# EasyEDA Pro project stm32f401rct6v2.eprj, board STM32F401RCT6V2
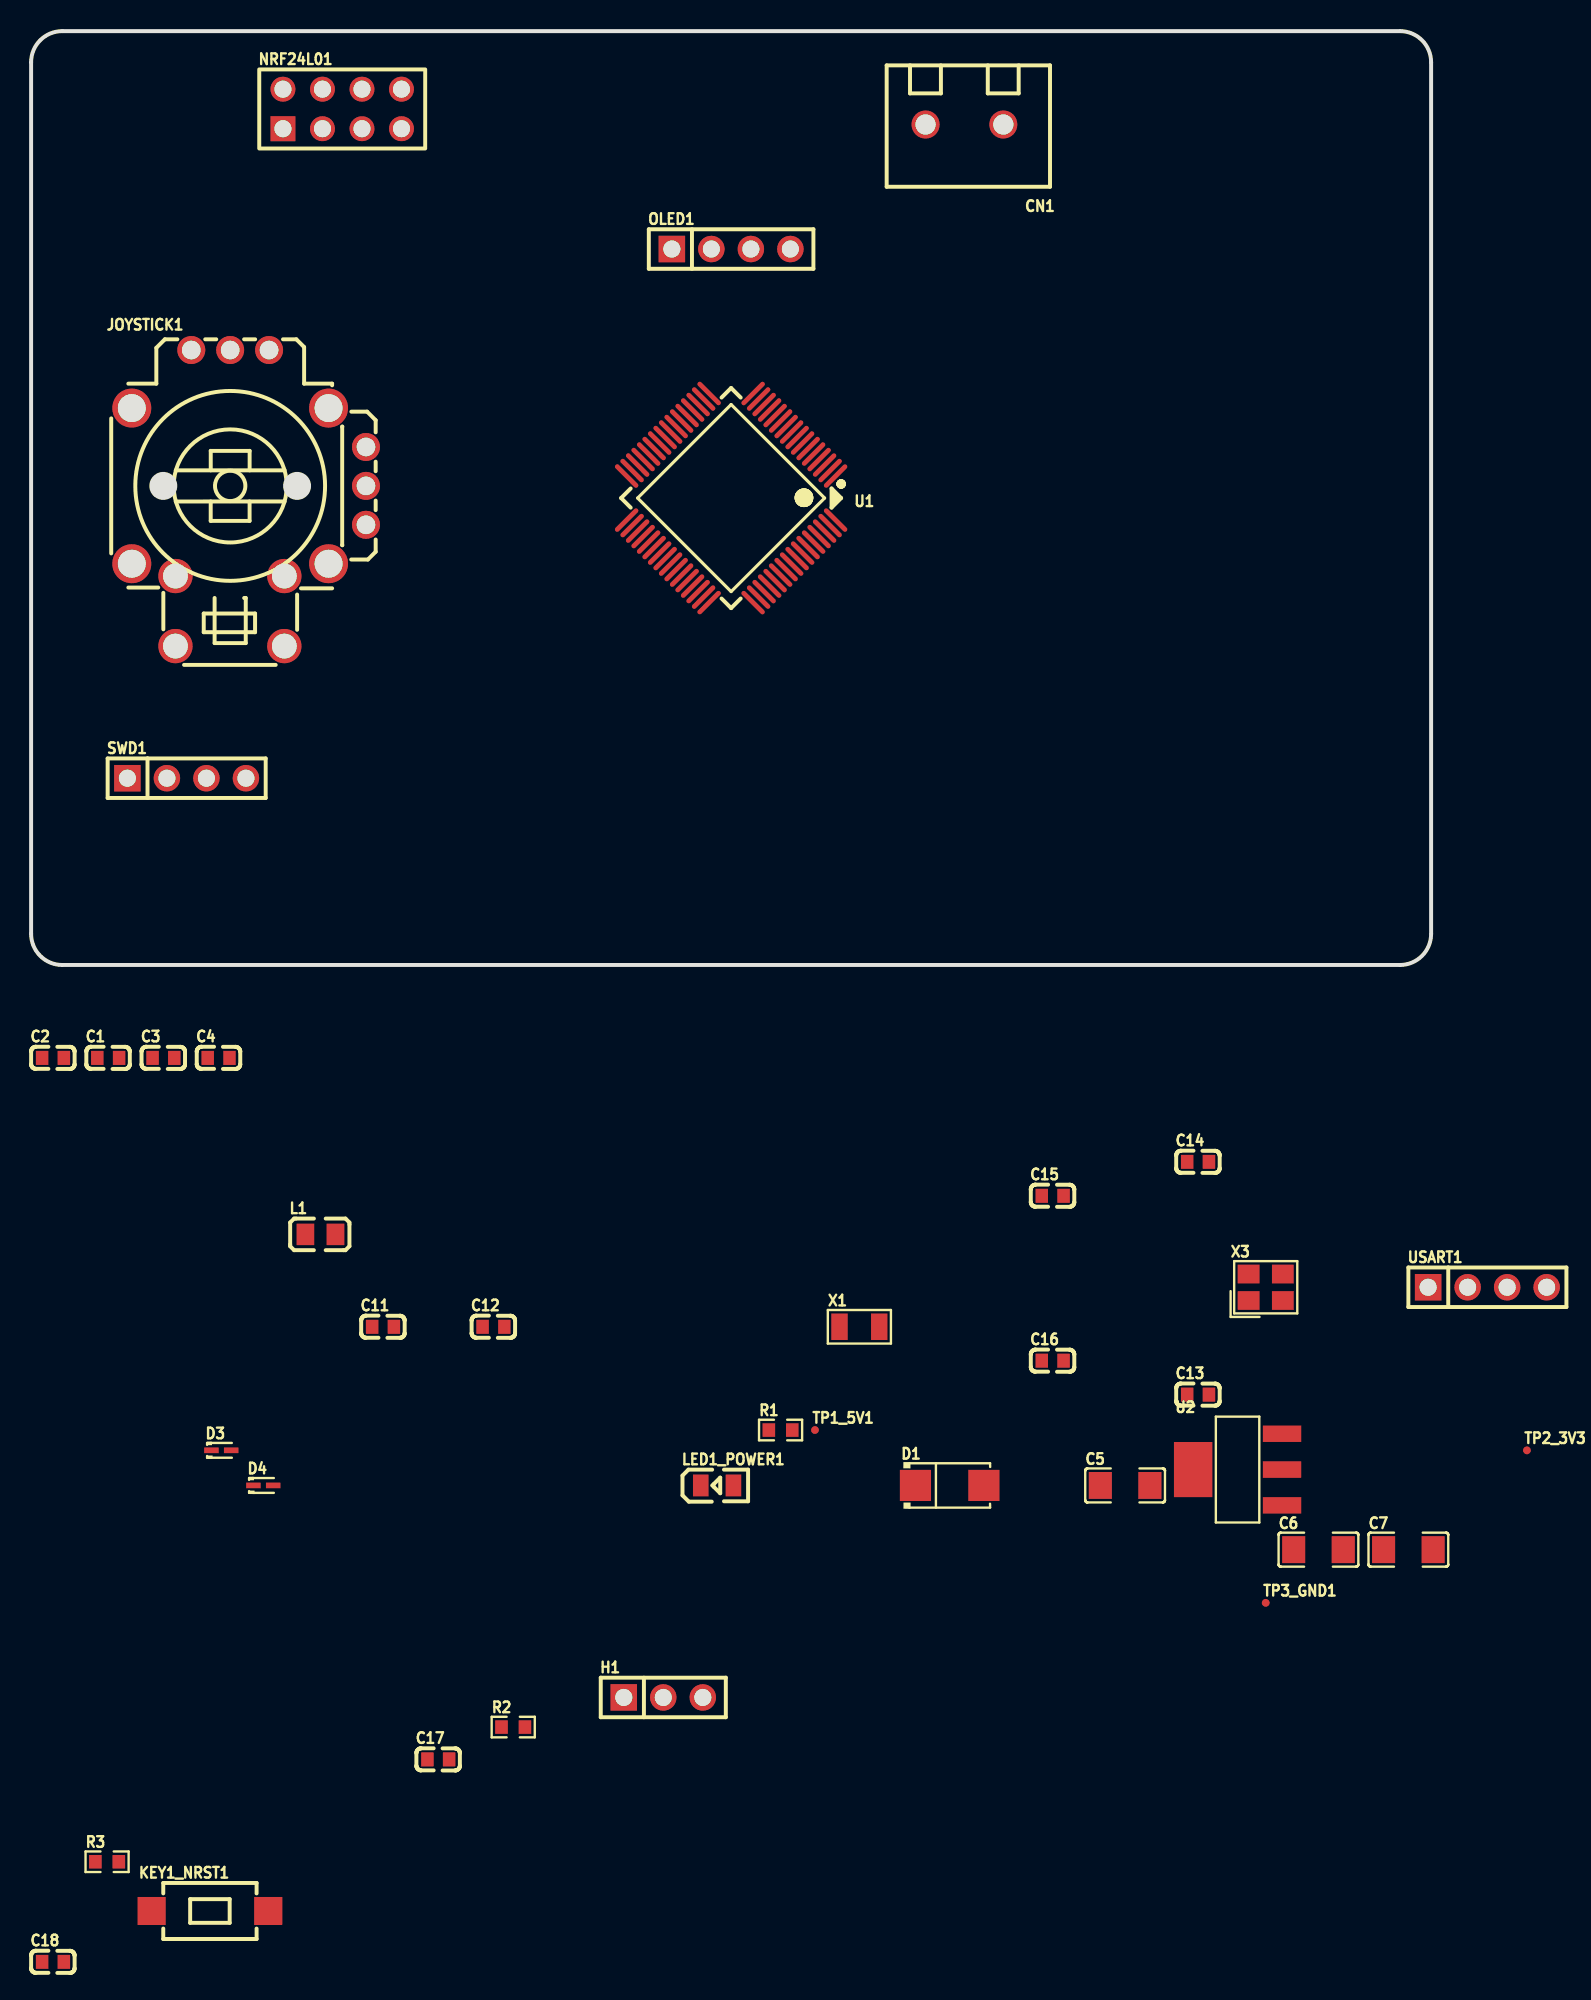
[diagram p4: board, top side]
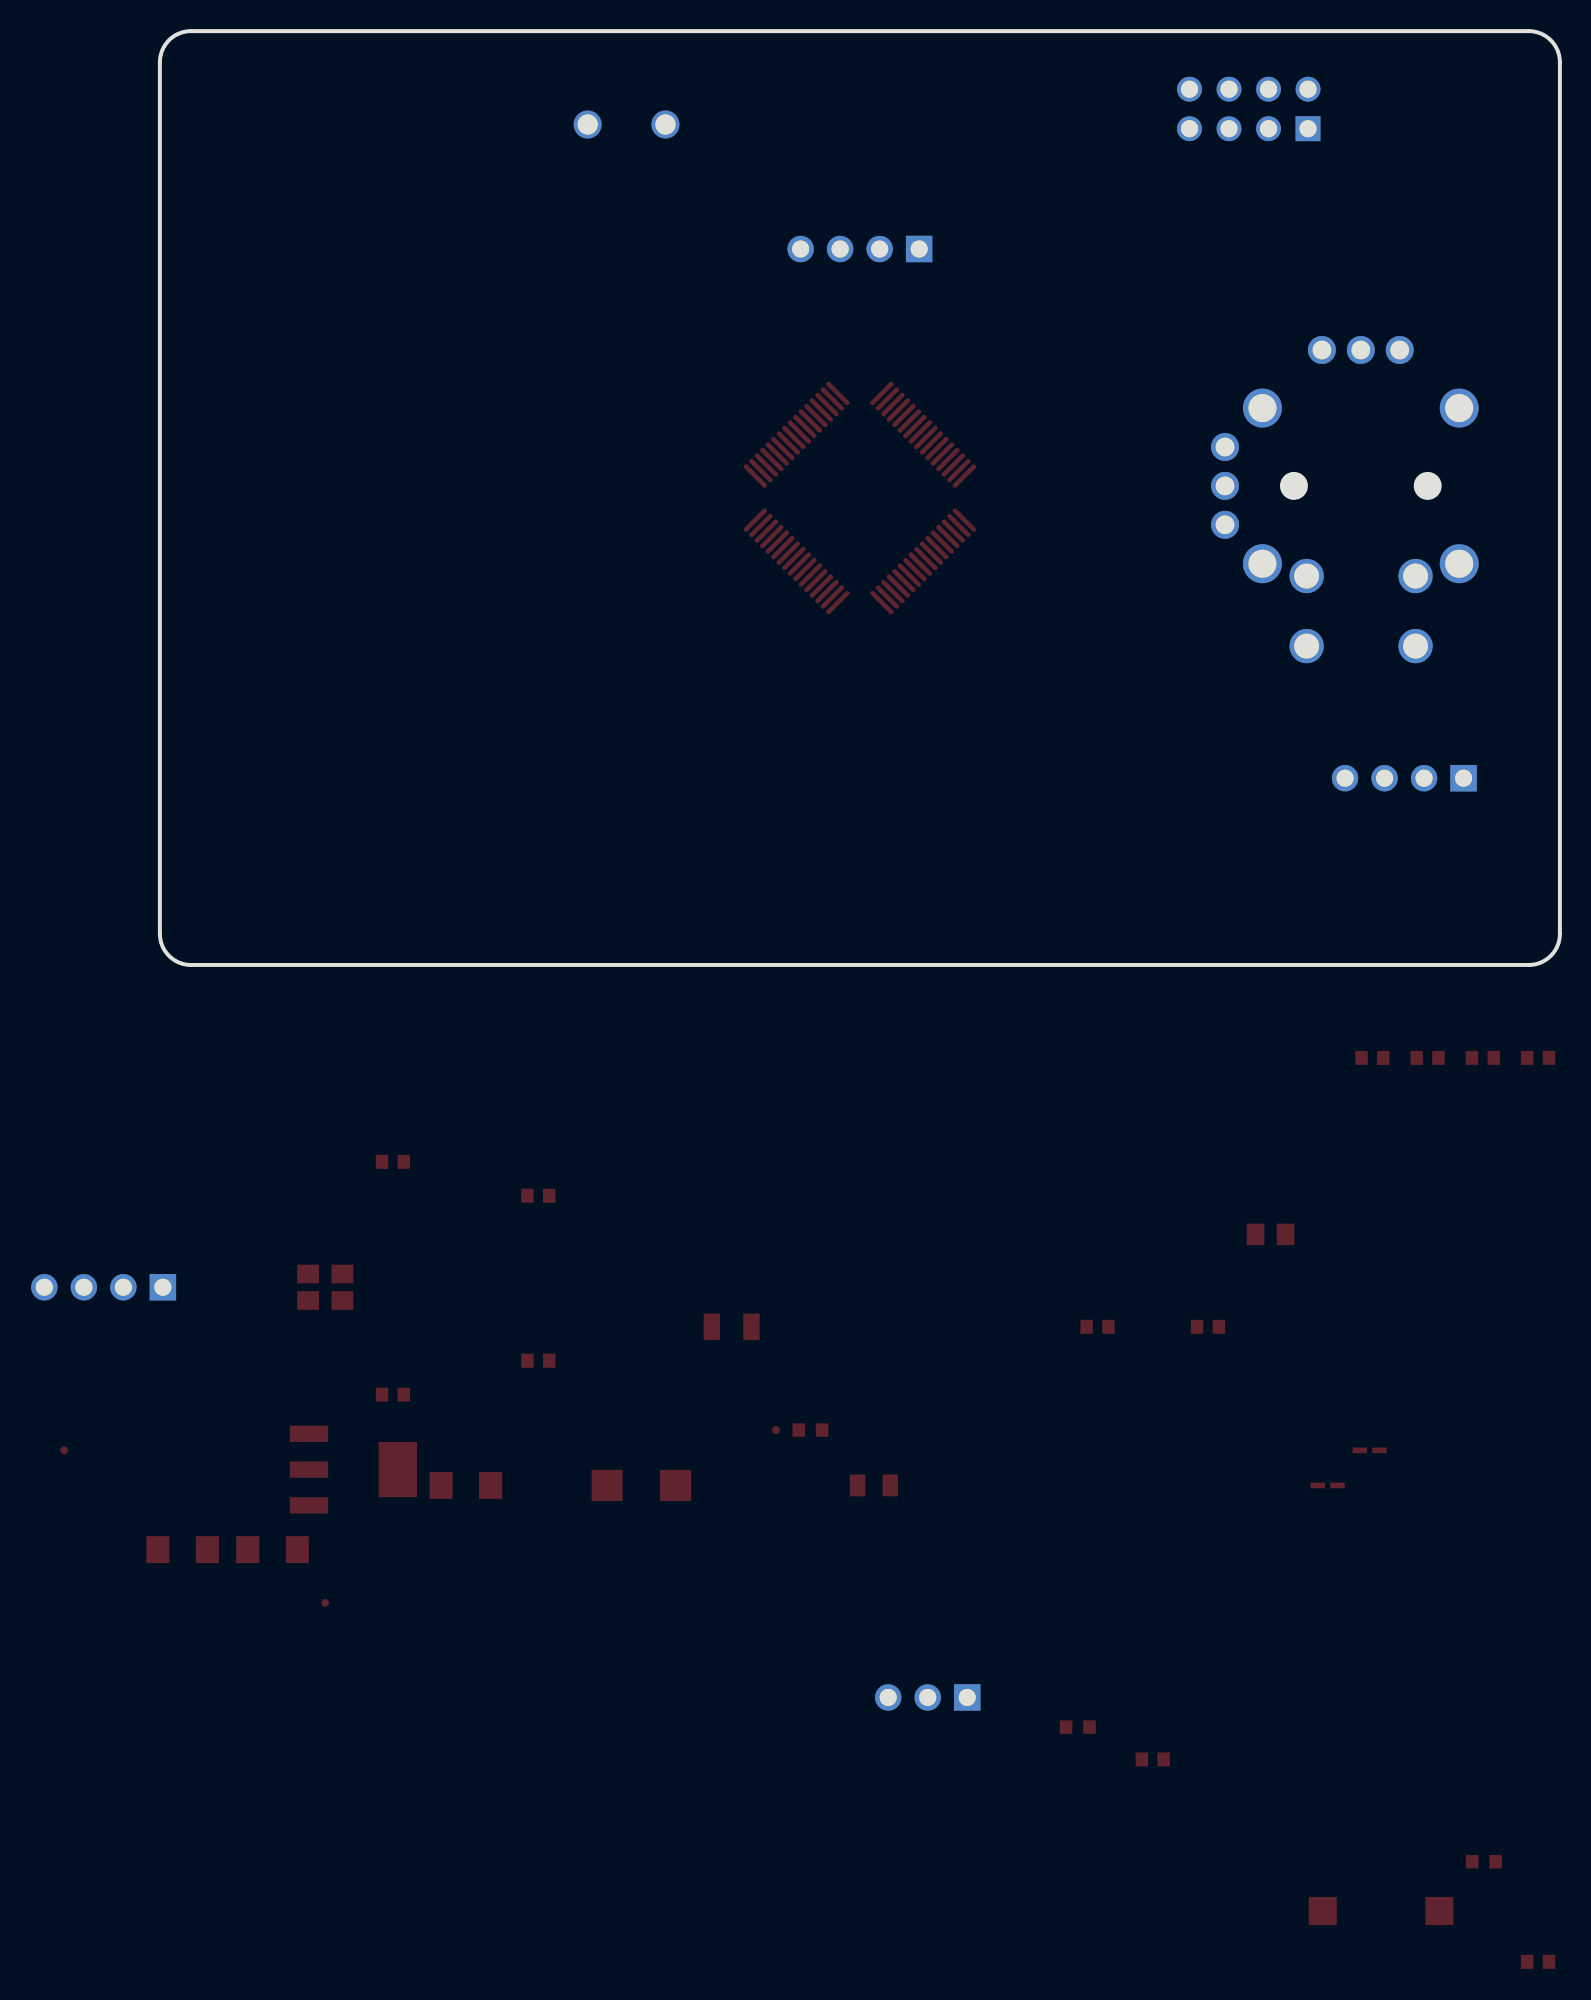
[diagram p5: board, bottom side, seen from below]

Outline 90 x 60 mm; copper layers: Top Layer, Bottom Layer. Coordinates in mm from the lower left corner of the outline.
Outline path: 0,58 0,2 arc(0.59,0.59) 2,0 88,0 arc(89.41,0.59) 90,2 90,58 arc(89.41,59.41) 88,60 2,60 arc(0.59,59.41) 0,58
Stack: Top Layer 0.035mm / Dielectric1 1.51mm FR4 er 4.5 / Bottom Layer 0.035mm

## Design rules (mm)
template: JLCPCB Capability(Two Layers Board)
spacing copperThickness1oz (default): track to track 0.102, other pairs 0.152 to 0.3
spacing copperThickness2oz: track to track 0.203, other pairs 0.152 to 0.3
track width copperThickness1oz (default): min 0.127, default 0.254, max 2.54
track width copperThickness2oz: min 0.203, default 0.254, max 2.54
differential pair differentialPair (default): width min 0.127, default 0.254, max 2.54; gap min 0.152, default 0.152
via viaSize (default): diameter min 0.5, default 0.61, max 10; hole min 0.3, default 0.305, max 6.3

## Placement (name value [footprint] x y rotation side)
C1  100nF  [C0603]  4.95 -5.97 0 top
C2  100nF  [C0603]  1.41 -5.97 0 top
C3  100nF  [C0603]  8.5 -5.97 0 top
C4  100nF  [C0603]  12.05 -5.97 0 top
C5  47uF  [C1206]  70.33 -33.44 0 top
C6  47uF  [C1206]  82.76 -37.57 0 top
C7  100nF  [C1206]  88.54 -37.57 0 top
C11  1uF  [C0603]  22.62 -23.25 0 top
C12  10nF  [C0603]  29.72 -23.25 0 top
C13  22pF  [C0603]  75.02 -27.61 0 top
C14  22pF  [C0603]  75.02 -12.65 0 top
C15  6pF  [C0603]  65.67 -14.83 0 top
C16  6pF  [C0603]  65.67 -25.43 0 top
C17  4.7uF  [C0603]  26.17 -51.04 0 top
C18  100nF  [C0603]  1.41 -64.05 0 top
CN1  MX126-5.0-02P-GN01-Cu-S-A  [CONN-TH_2P-P5.00_MX126-5.0-GN01-02P-CU-S-A]  60 54 180 top
D1  SMAJ5.0A  [SMA_L4.3-W2.6-LS5.2-RD]  59.05 -33.44 0 top
D3  1N4148WT  [SOD-523_L1.2-W0.8-LS1.6-RD]  12.23 -31.18 0 top
D4  1N4148WT  [SOD-523_L1.2-W0.8-LS1.6-RD]  14.93 -33.44 0 top
H1  PZ254V-11-03P  [HDR-TH_3P-P2.54-V-M]  40.64 -47.06 0 top
JOYSTICK1  RKJXV1224005  [SW-TH_RKJXV1224005]  14 30 0 top
KEY1_NRST1  TC-3602-4.3-260G  [KEY-SMD_L6.0-W3.6-LS8.3-L]  11.5 -60.78 0 top
L1  10uH  [L0805]  18.6 -17.31 0 top
LED1_POWER1  NCD0805R1  [LED0805-R-RD]  44.1 -33.44 0 top
NRF24L01  DS1023-2*4SF11  [HDR-TH_8P-P2.54-V-F-R2-C4-S2.54]  20 55 0 top
OLED1  PM254V-11-04-H85  [HDR-TH_4P-P2.54-V-F]  45 46 0 top
R1  1kΩ  [R0603]  48.18 -29.88 0 top
R2  10kΩ  [R0603]  30.99 -48.96 0 top
R3  10kΩ  [R0603]  4.88 -57.62 0 top
SWD1  PZ254V-11-04P  [HDR-TH_4P-P2.54-V-M]  10 12 0 top
TP1_5V1  -  [Test-Point-0.5mm]  50.39 -29.88 0 top
TP2_3V3  -  [Test-Point-0.5mm]  96.16 -31.18 0 top
TP3_GND1  -  [Test-Point-0.5mm]  79.37 -40.98 0 top
U1  STM32F401RCT6  [LQFP-64_L10.0-W10.0-P0.50-LS12.0-BL]  45 30 135 top
U2  AMS1117-3.3  [SOT-223_L6.5-W3.5-P2.30-LS7.0-BR]  77.56 -32.42 0 top
USART1  PZ254V-11-04P  [HDR-TH_4P-P2.54-V-M]  93.62 -20.71 0 top
X1  32.768kHz  [OSC-SMD_L3.2-W1.5]  53.25 -23.25 0 top
X3  25MHz  [CRYSTAL-SMD_4P-L3.2-W2.5-BL]  79.37 -20.71 0 top

## Footprints (pads in the part's own frame, mm; a bottom-side part is the same pattern mirrored in y, then rotated)
C0603
  rect 0.8x0.9 smd: 1(-0.7,0) 2(0.7,0)
C1206
  rect 1.485x1.728 smd: 1(-1.593,0) 2(1.593,0)
CONN-TH_2P-P5.00_MX126-5.0-GN01-02P-CU-S-A
  round 1.8 hole 1.3: 1(-2.5,0) 2(2.5,0)
CRYSTAL-SMD_4P-L3.2-W2.5-BL
  rect 1.4x1.2 smd: 1(-1.1,-0.85) 2(1.1,-0.85) 3(1.1,0.85) 4(-1.1,0.85)
HDR-TH_3P-P2.54-V-M
  rect 1.7x1.7 hole 1.1: 1(-2.54,0)
  round 1.7 hole 1.1: 2(0,0) 3(2.54,0)
HDR-TH_4P-P2.54-V-F
  rect 1.7x1.7 hole 1.1: 1(-3.81,0)
  round 1.7 hole 1.1: 2(-1.27,0) 3(1.27,0) 4(3.81,0)
HDR-TH_4P-P2.54-V-M
  rect 1.7x1.7 hole 1.1: 1(-3.81,0)
  round 1.7 hole 1.1: 2(-1.27,0) 3(1.27,0) 4(3.81,0)
HDR-TH_8P-P2.54-V-F-R2-C4-S2.54
  rect 1.6x1.6 hole 1.1: 1(-3.81,-1.27)
  round 1.6 hole 1.1: 2(-3.81,1.27) 3(-1.27,-1.27) 4(-1.27,1.27) 5(1.27,-1.27) 6(1.27,1.27) 7(3.81,-1.27) 8(3.81,1.27)
KEY-SMD_L6.0-W3.6-LS8.3-L
  rect 1.8x1.8 smd: 1(-3.75,0) 2(3.75,0)
L0805
  rect 1.133x1.377 smd: 1(-0.966,0) 2(0.966,0)
LED0805-R-RD
  rect 1x1.399 smd: 1(1.05,0) 2(-1.05,0)
LQFP-64_L10.0-W10.0-P0.50-LS12.0-BL
  oval 0.3x2 smd: 1(-3.75,-5.75) 2(-3.25,-5.75) 3(-2.75,-5.75) 4(-2.25,-5.75) 5(-1.75,-5.75) 6(-1.25,-5.75) 7(-0.75,-5.75) 8(-0.25,-5.75) 9(0.25,-5.75) 10(0.75,-5.75) 11(1.25,-5.75) 12(1.75,-5.75) 13(2.25,-5.75) 14(2.75,-5.75) 15(3.25,-5.75) 16(3.75,-5.75) 33(3.75,5.75) 34(3.25,5.75) 35(2.75,5.75) 36(2.25,5.75) 37(1.75,5.75) 38(1.25,5.75) 39(0.75,5.75) 40(0.25,5.75) 41(-0.25,5.75) 42(-0.75,5.75) 43(-1.25,5.75) 44(-1.75,5.75) 45(-2.25,5.75) 46(-2.75,5.75) 47(-3.25,5.75) 48(-3.75,5.75)
  oval 2x0.3 smd: 17(5.75,-3.75) 18(5.75,-3.25) 19(5.75,-2.75) 20(5.75,-2.25) 21(5.75,-1.75) 22(5.75,-1.25) 23(5.75,-0.75) 24(5.75,-0.25) 25(5.75,0.25) 26(5.75,0.75) 27(5.75,1.25) 28(5.75,1.75) 29(5.75,2.25) 30(5.75,2.75) 31(5.75,3.25) 32(5.75,3.75) 49(-5.75,3.75) 50(-5.75,3.25) 51(-5.75,2.75) 52(-5.75,2.25) 53(-5.75,1.75) 54(-5.75,1.25) 55(-5.75,0.75) 56(-5.75,0.25) 57(-5.75,-0.25) 58(-5.75,-0.75) 59(-5.75,-1.25) 60(-5.75,-1.75) 61(-5.75,-2.25) 62(-5.75,-2.75) 63(-5.75,-3.25) 64(-5.75,-3.75)
OSC-SMD_L3.2-W1.5
  rect 1.05x1.7 smd: 1(-1.275,0) 2(1.275,0)
R0603
  rect 0.806x0.864 smd: 1(-0.753,0) 2(0.753,0)
SMA_L4.3-W2.6-LS5.2-RD
  rect 2x2 smd: 1(-2.2,0) 2(2.2,0)
SOD-523_L1.2-W0.8-LS1.6-RD
  rect 0.93x0.36 smd: 1(-0.635,0) 2(0.635,0)
SOT-223_L6.5-W3.5-P2.30-LS7.0-BR
  rect 2.465x1.05 smd: 1(2.857,-2.3) 2(2.857,0) 3(2.857,2.3)
  rect 2.465x3.54 smd: 4(-2.857,0)
SW-TH_RKJXV1224005
  round 1.8 hole 1.2: 1(7.527,-1.719) 2(7.527,0.781) 3(7.527,3.281) 4(1.298,9.511) 5(-1.202,9.511) 6(-3.703,9.511)
  round 2.5 hole 1.8: 7(-7.527,5.781) 8(-7.527,-4.219) 9(5.122,-4.219) 10(5.122,5.781)
  round 2.2 hole 1.6: a(-4.721,-5.011) b(-4.721,-9.511) c(2.279,-5.011) d(2.279,-9.511)
Test-Point-0.5mm
  round 0.5 smd: 1(0,0)

## Nets
As in the schematic, except:
3V3: C1.1 C2.1 C3.1 C4.1 C6.1 C7.1 D4.2 H1.1 L1.1 NRF24L01.2 OLED1.1 R3.1 SWD1.3 TP2_3V3.1 U1.19 U1.32 U1.48 U1.64 U2.2 U2.4
+5V: C5.1 D1.1 R1.1 TP1_5V1.1 U2.3 USART1.3
GND: C1.2 C2.2 C3.2 C4.2 C5.2 C6.2 C7.2 C11.2 C12.2 C13.1 C14.1 C15.2 C16.2 C17.2 C18.1 CN1.1 D1.2 H1.3 KEY1_NRST1.2 LED1_POWER1.2 NRF24L01.1 OLED1.2 SWD1.4 TP3_GND1.1 U1.12 U1.18 U1.31 U1.47 U1.63 U2.1 USART1.4 X3.2 X3.4
ADC1_CHAN8: JOYSTICK1.5 U1.26
ADC1_CHAN9: JOYSTICK1.2 U1.27
SWCLK: SWD1.1 U1.49
$1N2498: LED1_POWER1.1 R1.2

Pads without a net: JOYSTICK1 1 3 4 6 7 8 9 10 a b c d; U1 2 8 9 10 11 24 25 28 29 33 34 35 36 37 38 39 40 50 51 52 53 54 55 56 57 61 62
